# Altium schematic sheet LED.SchDoc: WS2812B 8mm LED
size A4; DrawnBy: Denis Cooper; Engineer: Denis Cooper; DocumentNumber: 3; Revision: 0.1; SheetNumber: 3; SheetTotal: 3
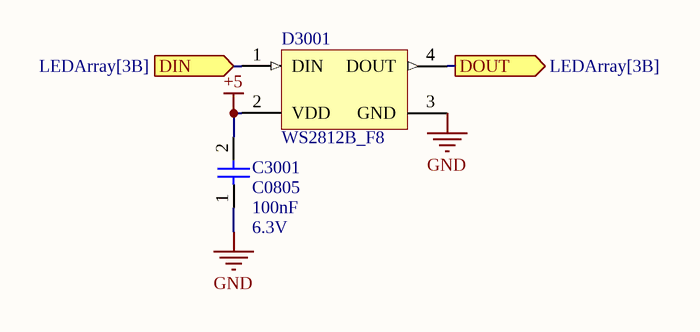
[diagram p0: LED.SchDoc]

## Parts
C3001  C0805  Capacitance: 100nF  Voltage: 6.3V  [CC0805]
D3001  WS2812B_F8  [WS2812B_F8]

## Ports
DIN (in, see LEDArray[3B]), DOUT (out, see LEDArray[3B])

## Nets
+5: C3001.2 D3001.2(VDD)
GND: C3001.1 D3001.3(GND)
DIN: D3001.1(DIN) ; port DIN
DOUT: D3001.4(DOUT) ; port DOUT

## Library data of the parts
C3001 = C0805: Capacitor; Tolerance: ±?%
D3001 = WS2812B_F8: Addressable 8mm LED; Voltage: 5V